# EAGLE schematic Optical_Alignment_Test_Board (EAGLE 7.4.0)
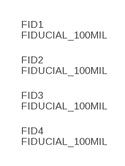
[diagram p0: schematic, sheet 1]

## Parts
FID1  FIDUCIAL_100MIL  [FIDUCIAL_100MIL]
FID2  FIDUCIAL_100MIL  [FIDUCIAL_100MIL]
FID3  FIDUCIAL_100MIL  [FIDUCIAL_100MIL]
FID4  FIDUCIAL_100MIL  [FIDUCIAL_100MIL]

## Library data of the parts
FID1-FID4 = MF_Aesthetics:FIDUCIAL: Library: MF_Aesthetics Description: Fiducial marking for PCB alignment inside PNP and other machines.; HOUSEPART: NO; POPULATE: 0